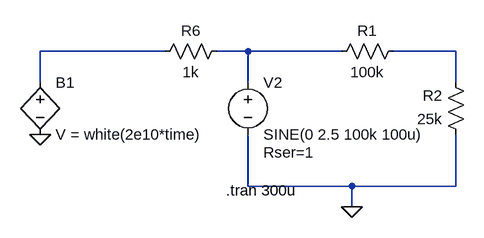
[diagram p0: schematic sim.asc]
sim.asc, the LTspice schematic file:
Version 4
SHEET 1 880 680
WIRE -64 112 -256 112
WIRE 64 112 16 112
WIRE 208 112 64 112
WIRE 384 112 288 112
WIRE -256 160 -256 112
WIRE 64 160 64 112
WIRE 384 160 384 112
WIRE 64 320 64 240
WIRE 224 320 64 320
WIRE 384 320 384 240
WIRE 384 320 224 320
WIRE 224 352 224 320
FLAG 224 352 0
FLAG -256 240 0
SYMBOL voltage 64 144 R0
WINDOW 123 0 0 Left 0
WINDOW 39 24 124 Left 2
SYMATTR InstName V2
SYMATTR Value SINE(0 2.5 100k 100u)
SYMATTR SpiceLine Rser=1
SYMBOL res 304 96 R90
WINDOW 0 0 56 VBottom 2
WINDOW 3 32 56 VTop 2
SYMATTR InstName R1
SYMATTR Value 100k
SYMBOL res 400 256 R180
WINDOW 0 36 76 Left 2
WINDOW 3 36 40 Left 2
SYMATTR InstName R2
SYMATTR Value 25k
SYMBOL res 32 96 R90
WINDOW 0 0 56 VBottom 2
WINDOW 3 32 56 VTop 2
SYMATTR InstName R6
SYMATTR Value 1k
SYMBOL bv -256 144 R0
SYMATTR InstName B1
SYMATTR Value V = white(2e10*time)
TEXT 30 326 Left 2 !.tran 300u

The netlist it stands for:
* sim.asc
V2 N002 0 SINE(0 2.5 100k 100u) Rser=1
R1 N003 N002 100k
R2 0 N003 25k
R6 N002 N001 1k
B1 N001 0 V = white(2e10*time)
.tran 300u
.backanno
.end